# Altium schematic sheet Sheet1.SCHDOC
size 209 x 297 mm; SheetTotal: 1; DocumentName: Sheet1.SCHDOC
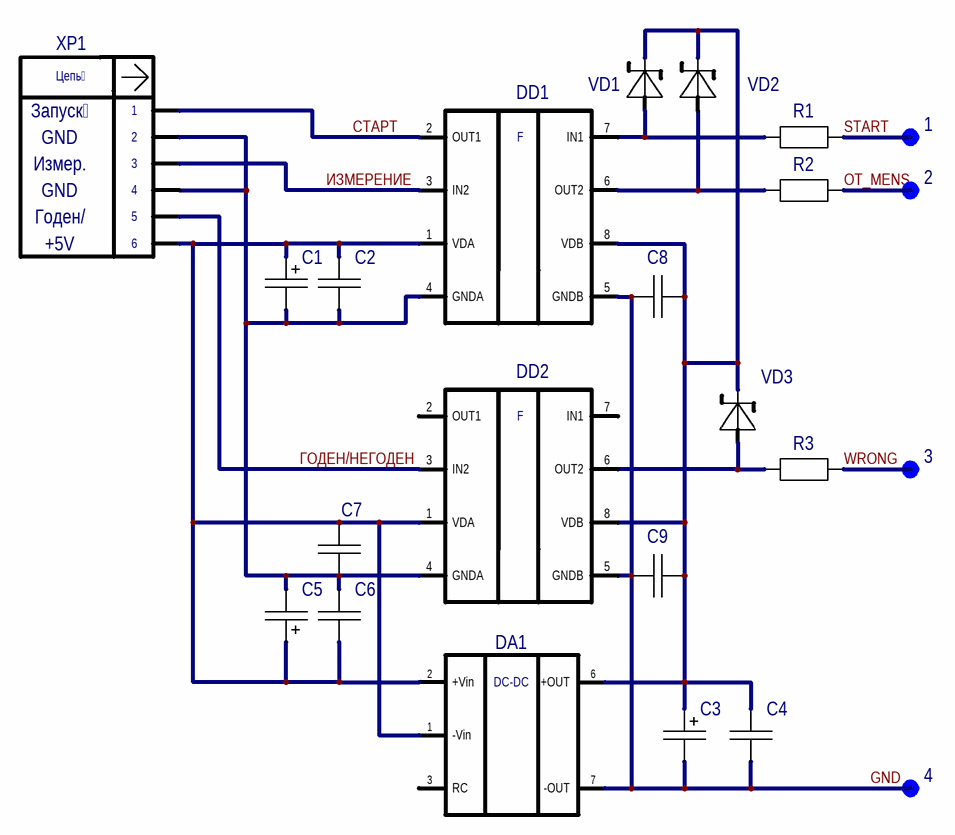
[diagram p0: Sheet1.SCHDOC]

## Parts
1  ТОЧКА ПАЙКИ 1  [LEPESTOK7_750_224]  (value not drawn)
2  ТОЧКА ПАЙКИ 1  [LEPESTOK7_750_224]  (value not drawn)
3  ТОЧКА ПАЙКИ 1  [LEPESTOK7_750_224]  (value not drawn)
4  ТОЧКА ПАЙКИ 1  [LEPESTOK7_750_224]  (value not drawn)
C1  TAJB476K10RNJ  [TANT_B]  (value not drawn)
C2  0805-2F3-0,1 MKФ  [0805]  (value not drawn)
C3  TAJB476K10RNJ  [TANT_B]  (value not drawn)
C4  0805-2F3-0,1 MKФ  [0805]  (value not drawn)
C5  TAJB476K10RNJ  [TANT_B]  (value not drawn)
C6  0805-2F3-0,1 MKФ  [0805]  (value not drawn)
C7  0805-2F3-0,1 MKФ  [0805]  (value not drawn)
C8  0805-2F3-0,1 MKФ  [0805]  (value not drawn)
C9  0805-2F3-0,1 MKФ  [0805]  (value not drawn)
DA1  ПРЕОБРАЗОВАТЕЛЬ SPB 03E-05  [SPB 03]  (value not drawn)
DD1  ADUM1201AR  [R-8]  (value not drawn)
DD2  ADUM1201AR  [R-8]  (value not drawn)
R1  1206-100 ОМ+-5%  [1206]  (value not drawn)
R2  1206-100 ОМ+-5%  [1206]  (value not drawn)
R3  1206-100 ОМ+-5%  [1206]  (value not drawn)
VD1  BAT 42WS  [SOD-323]  (value not drawn)
VD2  BAT 42WS  [SOD-323]  (value not drawn)
VD3  BAT 42WS  [SOD-323]  (value not drawn)
XP1  AMP II 280372-2  [AMPMODU-0-280372-2_1X6]  (value not drawn)

## Nets
GND: 4.1 C3.2 C4.1 C8.2 C9.2 DA1.7(-OUT) DD1.5(GNDB) DD2.5(GNDB)
OT_MENS: 2.1 R2.2
START: 1.1 R1.2
WRONG: 3.1 R3.2
ГОДЕН/НЕГОДЕН: DD2.3(IN2) XP1.5
ИЗМЕРЕНИЕ: DD1.3(IN2) XP1.3
СТАРТ: DD1.2(OUT1) XP1.1
NetC1_1: C1.1 C2.2 C5.1 C6.2 C7.2 DA1.1(-Vin) DA1.2(+Vin) DD1.1(VDA) DD2.1(VDA) XP1.6
NetC1_2: C1.2 C2.1 C5.2 C6.1 C7.1 DD1.4(GNDA) DD2.4(GNDA) XP1.2 XP1.4
NetC3_1: C3.1 C4.2 C8.1 C9.1 DA1.6(+OUT) DD1.8(VDB) DD2.8(VDB) VD1.2(-) VD2.2(-) VD3.2(-)
NetDD1_6: DD1.6(OUT2) R2.1 VD2.1(+)
NetDD1_7: DD1.7(IN1) R1.1 VD1.1(+)
NetDD2_6: DD2.6(OUT2) R3.1 VD3.1(+)

Not connected (* = marked no-connect by the designer): DA1 3(RC) 5 8; DD2 2(OUT1) 7(IN1)

## Notes on the sheet
- GND
- Запуск
- Измер.
- Годен/
- +5V
- Перв. примен.
- Справ. №
- Подп. дата
- Инв. № дубл.
- Взам. инв. №
- Подп. и дата
- Изм.
- Разраб.
- Лист
- № докум.
- Подп.
- Дата
- Лит.
- Масса
- Масштаб
- Пров.
- Т.контр.
- Листов
- Инв. № подл.
- Н.контр.
- Утв.
- Файл:
- ALTIUM GOSTBOM2.0 KEV
- Копировал
- Формат А4
- (in symbol ADUM1201AR) F
- (in symbol AMP II 280372-2) Цепь
- (in symbol ПРЕОБРАЗОВАТЕЛЬ SPB 03E-05) DC-DC

## Library data of the parts
1-4 = ТОЧКА ПАЙКИ 1: Name: Точка пайки; Value: *
C1 C3 C5 = TAJB476K10RNJ: Standart: AVX; Name2: TAJB476K10RNJ; Name1: TAJB476K10RNJ
C2 C4 C6-C9 = 0805-2F3-0,1 MKФ: Standart: Murata; Name2: Конденсатор 0805-2F3-0,1 мкФ; Value: *; Name1: Конденсатор 0805-2F3-0,1 мкФ
DA1 = ПРЕОБРАЗОВАТЕЛЬ SPB 03E-05: Standart: MEN WELL; Value: *; Name2: Преобразователь SPB03E-05; Name1: Преобразователь SPB03E-05
DD1 DD2 = ADUM1201AR: Standart: Analog Devices; Value: *; Name2: ADuM1201AR; Name1: ADuM1201AR
R1-R3 = 1206-100 ОМ+-5%: Name1: Резистор 1206-100 Ом+-5%; Name2: Резистор 1206-100 Ом+-5%
VD1-VD3 = BAT 42WS: Standart: ELFA (70-180-96); Name2: Диод BAT 42WS; Value: *; Name1: Диод BAT 42WS
XP1 = AMP II 280372-2: Standart: ELFA (43-836-26); Name2: Вилка AMPMODU II-280372-2; Value: *; Name1: Вилка AMPMODU II-280372-2